# EAGLE design DRV10987 (EAGLE 8.7.1)
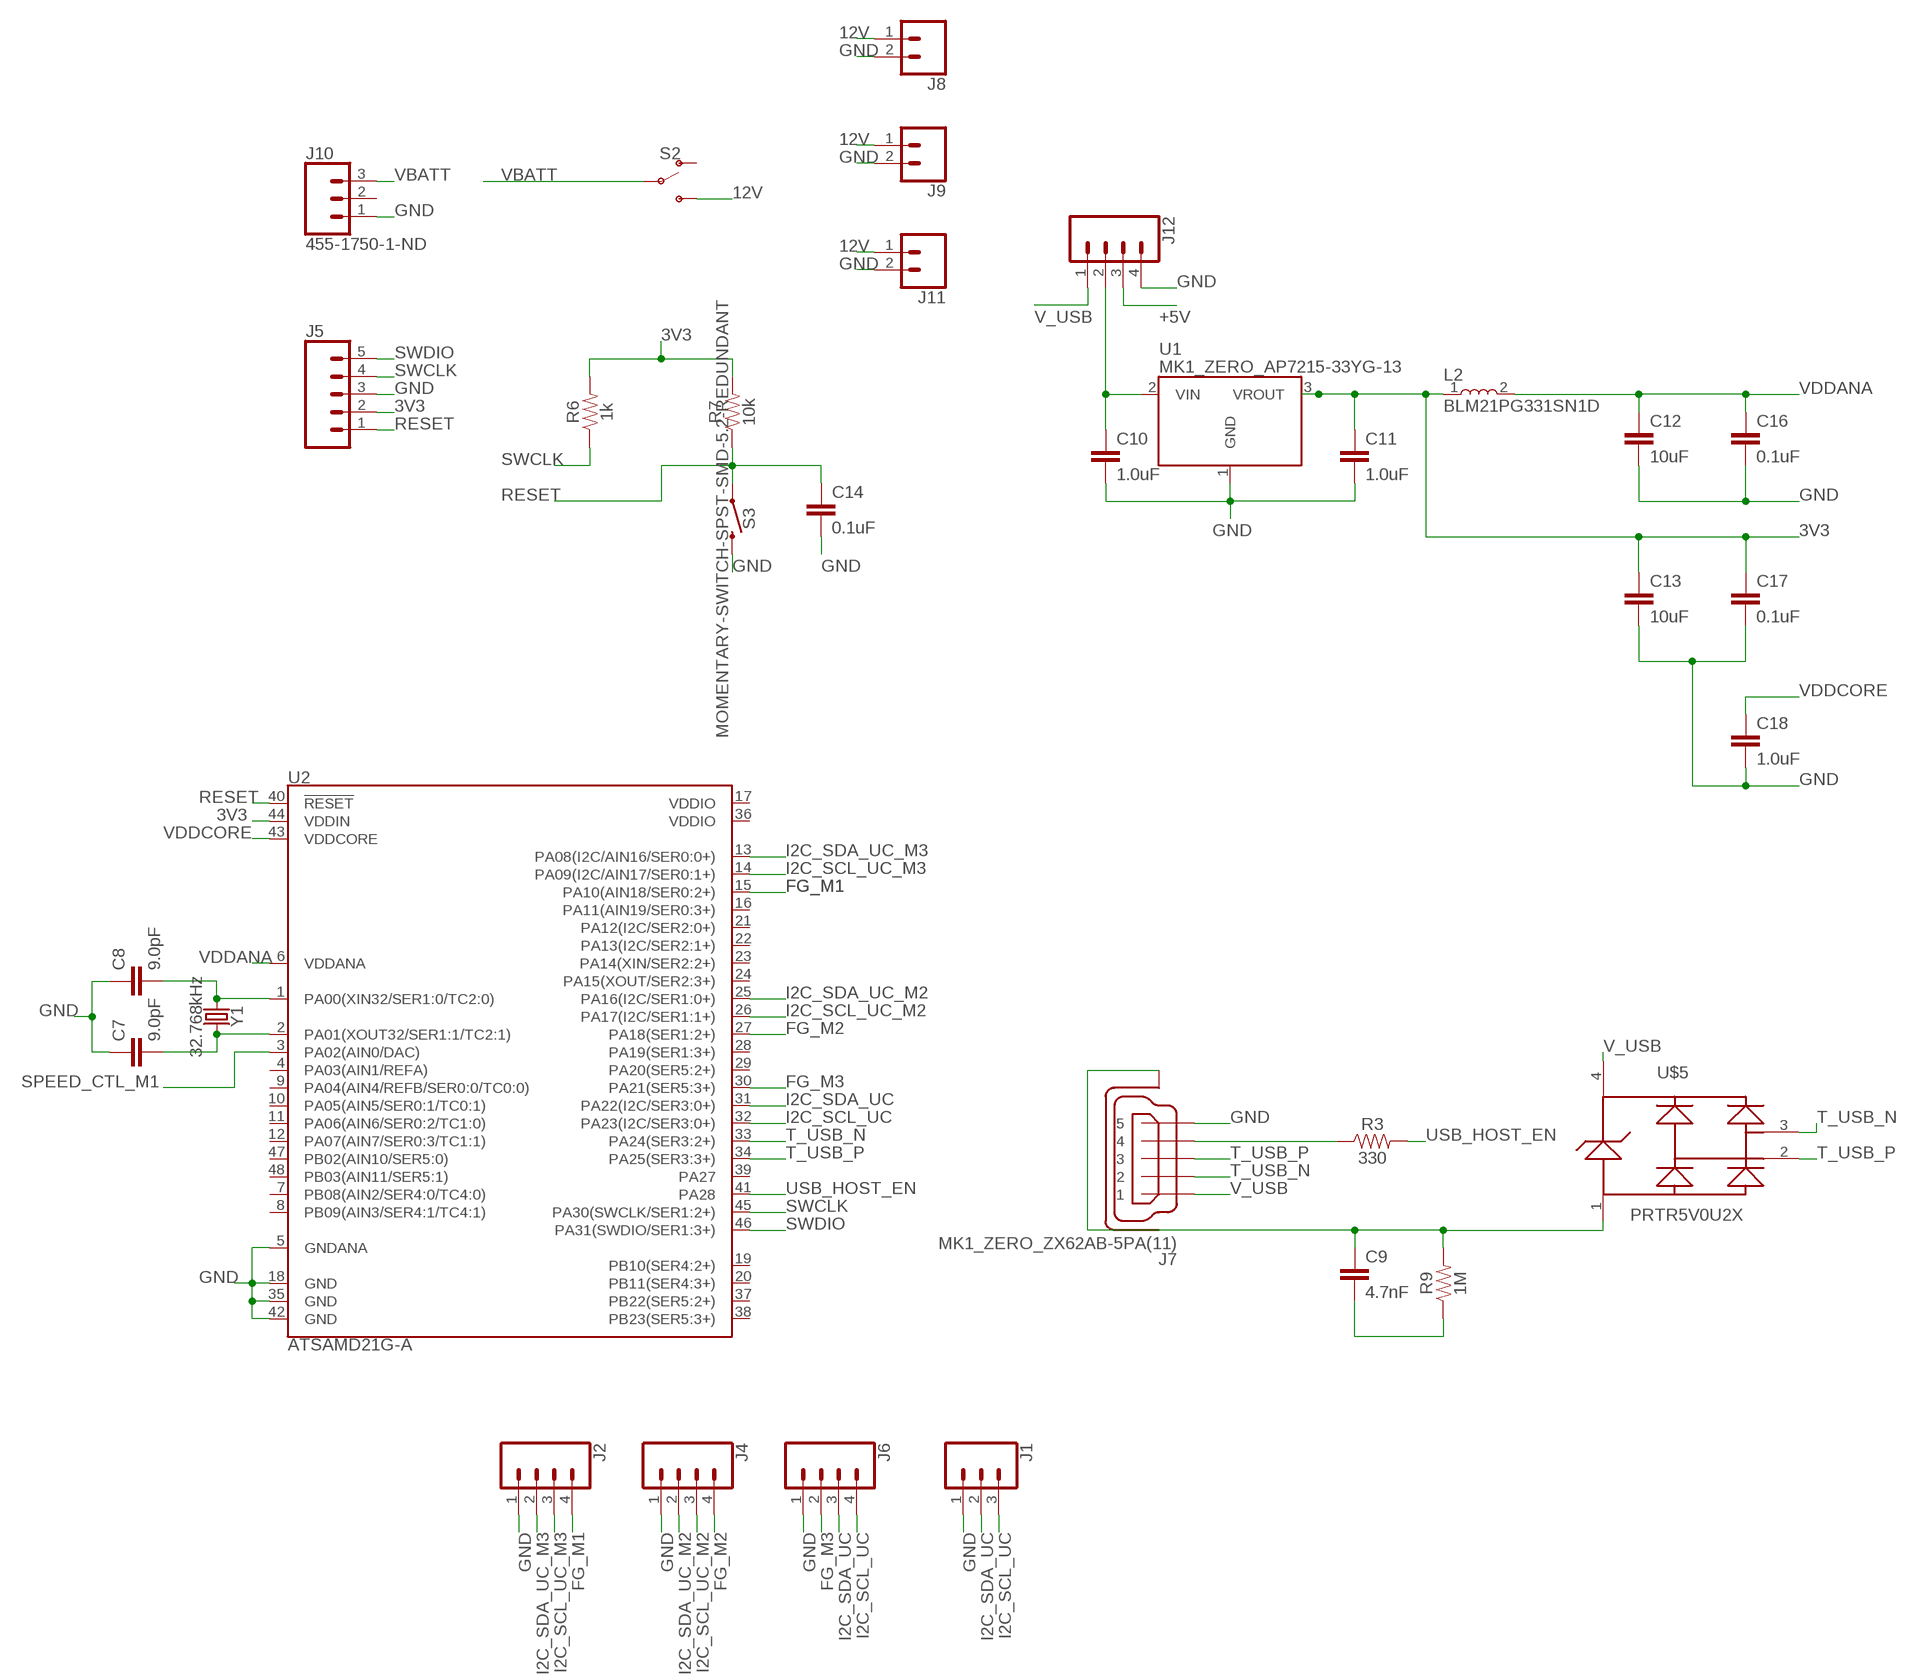
[diagram p0: schematic, sheet 1]

## Parts
C7  9.0pF  9.0PF-0603-50V-10%  [0603]
C8  9.0pF  9.0PF-0603-50V-10%  [0603]
C9  4.7nF  4.7PF-0603-50V-5%  [0603]
C10  1.0uF  1.0UF-0805-25V-(+80/-20%)  [0805]
C11  1.0uF  1.0UF-0805-25V-(+80/-20%)  [0805]
C12  10uF  10UF-0805-10V-10%  [0805]
C13  10uF  10UF-0805-10V-10%  [0805]
C14  0.1uF  1.0UF-0805-25V-(+80/-20%)  [0805]
C16  0.1uF  1.0UF-0805-25V-(+80/-20%)  [0805]
C17  0.1uF  1.0UF-0805-25V-(+80/-20%)  [0805]
C18  1.0uF  1.0UF-0805-25V-(+80/-20%)  [0805]
J1  CONN_03LOCK  [1X03_LOCK]
J2  CONN_04LOCK  [1X04_LOCK]
J4  CONN_04LOCK  [1X04_LOCK]
J5  CONN_05LOCK_LONGPADS  [1X05_LOCK_LONGPADS]
J6  CONN_04LOCK  [1X04_LOCK]
J7  MK1_ZERO_ZX62AB-5PA(11)  [MK1_ZERO_USBMICRO-ZX62-AB-5PA]
J8  CONN_02LOCK  [1X02_LOCK]
J9  CONN_02LOCK  [1X02_LOCK]
J10  455-1750-1-ND  CONN_03  [1X03]
J11  CONN_02LOCK  [1X02_LOCK]
J12  CONN_04LOCK  [1X04_LOCK]
L2  BLM21PG331SN1D  [INDC2012X87]
R3  330  330OHM-0603-1/10W-1%  [0603]
R6  1k  1KOHM-0603-1/10W-1%  [0603]
R7  10k  10KOHM-0603-1/10W-1%  [0603]
R9  1M  1MOHM-0603-1/4W-5%  [0603]
S2  SWITCH-SPDT-PTH-11.6X4.0MM  [SWITCH_SPDT_PTH_11.6X4.0MM]
S3  MOMENTARY-SWITCH-SPST-SMD-5.2-REDUNDANT  [TACTILE_SWITCH_SMD_5.2MM]
U1  MK1_ZERO_AP7215-33YG-13  [MK1_ZERO_SOT150P400X160-3N]
U2  ATSAMD21G-A  [TQFP-48]
U$5  ARDUINO_PRTR5V0U2XB  [ARDUINO_SOT143B]
Y1  32.768kHz  CRYSTAL-32.768KHZSMD-3.2X1.5  [CRYSTAL-SMD-3.2X1.5MM]

## Nets
3V3: C11.1 C13.1 C17.1 J5.2 L2.1 R6.2 R7.2 U1.3(VROUT) U2.44(VDDIN)
12V: J8.1 J9.1 J11.1 S2.3(S)
+5V: J12.3
FG_M1: J2.4 U2.15(PA10(AIN18/SER0:2+))
FG_M2: J4.4 U2.27(PA18(SER1:2+))
FG_M3: J6.2 U2.30(PA21(SER5:3+))
GND: C7.1 C8.1 C10.2 C11.2 C12.2 C13.2 C14.2 C16.2 C17.2 C18.2 J1.1 J2.1 J4.1 J5.3 J6.1 J7.5 J8.2 J9.2 J10.1 J11.2 J12.4 S3.3 S3.4 U1.1(GND) U2.5(GNDANA) U2.18(GND) U2.35(GND) U2.42(GND)
I2C_SCL_UC: J1.3 J6.4 U2.32(PA23(I2C/SER3:0+))
I2C_SCL_UC_M2: J4.3 U2.26(PA17(I2C/SER1:1+))
I2C_SCL_UC_M3: J2.3 U2.14(PA09(I2C/AIN17/SER0:1+))
I2C_SDA_UC: J1.2 J6.3 U2.31(PA22(I2C/SER3:0+))
I2C_SDA_UC_M2: J4.2 U2.25(PA16(I2C/SER1:0+))
I2C_SDA_UC_M3: J2.2 U2.13(PA08(I2C/AIN16/SER0:0+))
N$1: J7.4 R3.1
N$8: C7.2 U2.2(PA01(XOUT32/SER1:1/TC2:1)) Y1.P$2
N$10: C8.2 U2.1(PA00(XIN32/SER1:0/TC2:0)) Y1.P$1
N$17: C9.1 J7.6(SH) J7.7(SH) J7.8(SH) J7.9(SH) J7.10(SH) J7.11(SH) R9.2 U$5.1
N$19: C9.2 R9.1
N$20: C10.1 J12.2 U1.2(VIN)
RESET: C14.1 J5.1 R7.1 S3.1 S3.2 U2.40(!RESET!)
SPEED_CTL_M1: U2.3(PA02(AIN0/DAC))
SWCLK: J5.4 R6.1 U2.45(PA30(SWCLK/SER1:2+))
SWDIO: J5.5 U2.46(PA31(SWDIO/SER1:3+))
T_USB_N: J7.2 U2.33(PA24(SER3:2+)) U$5.3
T_USB_P: J7.3 U2.34(PA25(SER3:3+)) U$5.2
USB_HOST_EN: R3.2 U2.41(PA28)
V_USB: J7.1 J12.1 U$5.4
VBATT: J10.3 S2.2(P)
VDDANA: C12.1 C16.1 L2.2 U2.6(VDDANA)
VDDCORE: C18.1 U2.43(VDDCORE)
Unconnected: J10.2 S2.1(O) U2.4(PA03(AIN1/REFA)) U2.7(PB08(AIN2/SER4:0/TC4:0)) U2.8(PB09(AIN3/SER4:1/TC4:1)) U2.9(PA04(AIN4/REFB/SER0:0/TC0:0)) U2.10(PA05(AIN5/SER0:1/TC0:1)) U2.11(PA06(AIN6/SER0:2/TC1:0)) U2.12(PA07(AIN7/SER0:3/TC1:1)) U2.16(PA11(AIN19/SER0:3+)) U2.17(VDDIO) U2.19(PB10(SER4:2+)) U2.20(PB11(SER4:3+)) U2.21(PA12(I2C/SER2:0+)) U2.22(PA13(I2C/SER2:1+)) U2.23(PA14(XIN/SER2:2+)) U2.24(PA15(XOUT/SER2:3+)) U2.28(PA19(SER1:3+)) U2.29(PA20(SER5:2+)) U2.36(VDDIO) U2.37(PB22(SER5:2+)) U2.38(PB23(SER5:3+)) U2.39(PA27) U2.47(PB02(AIN10/SER5:0)) U2.48(PB03(AIN11/SER5:1))

## Library data of the parts
C7 C8 = SparkFun-Capacitors:9.0PF: 9.0pF ceramic capacitors A capacitor is a passive two-terminal electrical component used to store electrical energy temporarily in an electric field.; PROD_ID: CAP-09341
C9 = SparkFun-Capacitors:4.7PF: 4.7pF ceramic capacitors A capacitor is a passive two-terminal electrical component used to store electrical energy temporarily in an electric field.; PROD_ID: CAP-07880; VALUE: 4.7pF
C10 C11 C18 = SparkFun-Capacitors:1.0UF: 1µF ceramic capacitors A capacitor is a passive two-terminal electrical component used to store electrical energy temporarily in an electric field.; PROD_ID: CAP-11625
C12 C13 = SparkFun-Capacitors:10UF: 10.0µF ceramic capacitors A capacitor is a passive two-terminal electrical component used to store electrical energy temporarily in an electric field.; PROD_ID: CAP-11330
C14 C16 C17 = SparkFun-Capacitors:1.0UF: 1µF ceramic capacitors A capacitor is a passive two-terminal electrical component used to store electrical energy temporarily in an electric field.; PROD_ID: CAP-11625; VALUE: 1.0uF
J1 = SparkFun-Connectors:CONN_03: Multi connection point. Often used as Generic Header-pin footprint for 0.1 inch spaced/style header connections On any of the 0.1 inch spaced packages, you can populate with these: Break Away Headers - Straight <https://www.sparkfun.com/products/116> (PRT-00116) Break Away Male Headers - Right Angle <https://www.sparkfun.com/products/553> (PRT-00553) Female Headers <https://www.sparkfun.com/products/115> (PRT-00115) Break Away Headers - Machine Pin <https://www.sparkfun.com/products/117> (PRT-00117) Break Away Female Headers - Swiss Machine Pin <https://www.sparkfun.com/products/743> (PRT-00743) Stackable Header - 3 Pin (Female, 0.1") <https://www.sparkfun.com/products/13875> (PRT-13875) For SCREWTERMINALS and SPRING TERMINALS visit here: Screw Terimnals on SparkFun.com <https://www.sparkfun.com/search/results?term=Screw+Terminals> (5mm/3.5mm/2.54mm spacing) This device is also useful as a general connection point to wire up your design to another part of your project. Our various solder wires solder well into these plated through hole pads. Hook-Up Wire - Assortment (Stranded, 22 AWG) <https://www.sparkfun.com/products/11375> (PRT-11375) Hook-Up Wire - Assortment (Solid Core, 22 AWG) <https://www.sparkfun.com/products/11367> (PRT-11367) View the entire wire category on our website here <https://www.sparkfun.com/categories/141> Special notes: Molex polarized connector foot print use with SKU : PRT-08232 with associated crimp pins and housings.
J2 J4 J6 J12 = SparkFun-Connectors:CONN_04: Multi connection point. Often used as Generic Header-pin footprint for 0.1 inch spaced/style header connections On any of the 0.1 inch spaced packages, you can populate with these: Break Away Headers - Straight <https://www.sparkfun.com/products/116> (PRT-00116) Break Away Male Headers - Right Angle <https://www.sparkfun.com/products/553> (PRT-00553) Female Headers <https://www.sparkfun.com/products/115> (PRT-00115) Break Away Headers - Machine Pin <https://www.sparkfun.com/products/117> (PRT-00117) Break Away Female Headers - Swiss Machine Pin <https://www.sparkfun.com/products/743> (PRT-00743) For SCREWTERMINALS and SPRING TERMINALS visit here: Screw Terimnals on SparkFun.com <https://www.sparkfun.com/search/results?term=Screw+Terminals> (5mm/3.5mm/2.54mm spacing) This device is also useful as a general connection point to wire up your design to another part of your project. Our various solder wires solder well into these plated through hole pads. Hook-Up Wire - Assortment (Stranded, 22 AWG) <https://www.sparkfun.com/products/11375> (PRT-11375) Hook-Up Wire - Assortment (Solid Core, 22 AWG) <https://www.sparkfun.com/products/11367> (PRT-11367) View the entire wire category on our website here <https://www.sparkfun.com/categories/141> Special notes: Molex polarized connector foot print use with SKU : PRT-08231 with associated crimp pins and housings. 1MM SMD Version SKU: PRT-10208; PROD_ID: CONN-09696
J5 = SparkFun-Connectors:CONN_05: Multi connection point. Often used as Generic Header-pin footprint for 0.1 inch spaced/style header connections On any of the 0.1 inch spaced packages, you can populate with these: Break Away Headers - Straight <https://www.sparkfun.com/products/116> (PRT-00116) Break Away Male Headers - Right Angle <https://www.sparkfun.com/products/553> (PRT-00553) Female Headers <https://www.sparkfun.com/products/115> (PRT-00115) Break Away Headers - Machine Pin <https://www.sparkfun.com/products/117> (PRT-00117) Break Away Female Headers - Swiss Machine Pin <https://www.sparkfun.com/products/743> (PRT-00743) For SCREWTERMINALS and SPRING TERMINALS visit here: Screw Terimnals on SparkFun.com <https://www.sparkfun.com/search/results?term=Screw+Terminals> (5mm/3.5mm/2.54mm spacing) This device is also useful as a general connection point to wire up your design to another part of your project. Our various solder wires solder well into these plated through hole pads. Hook-Up Wire - Assortment (Stranded, 22 AWG) <https://www.sparkfun.com/products/11375> (PRT-11375) Hook-Up Wire - Assortment (Solid Core, 22 AWG) <https://www.sparkfun.com/products/11367> (PRT-11367) View the entire wire category on our website here <https://www.sparkfun.com/categories/141> Special notes: Molex polarized connector foot print use with SKU : PRT-08231 with associated crimp pins and housings. 1MM SMD Version SKU: PRT-10208
J7 = MKRZero_V5.0:MK1_ZERO_ZX62AB-5PA(11)
J8 J9 J11 = SparkFun-Connectors:CONN_02: Multi connection point. Often used as Generic Header-pin footprint for 0.1 inch spaced/style header connections On any of the 0.1 inch spaced packages, you can populate with these: Break Away Headers - Straight <https://www.sparkfun.com/products/116> (PRT-00116) Break Away Male Headers - Right Angle <https://www.sparkfun.com/products/553> (PRT-00553) Female Headers <https://www.sparkfun.com/products/115> (PRT-00115) Break Away Headers - Machine Pin <https://www.sparkfun.com/products/117> (PRT-00117) Break Away Female Headers - Swiss Machine Pin <https://www.sparkfun.com/products/743> (PRT-00743) For SCREWTERMINALS and SPRING TERMINALS visit here: Screw Terimnals on SparkFun.com <https://www.sparkfun.com/search/results?term=Screw+Terminals> (5mm/3.5mm/2.54mm spacing) This device is also useful as a general connection point to wire up your design to another part of your project. Our various solder wires solder well into these plated through hole pads. Hook-Up Wire - Assortment (Stranded, 22 AWG) <https://www.sparkfun.com/products/11375> (PRT-11375) Hook-Up Wire - Assortment (Solid Core, 22 AWG) <https://www.sparkfun.com/products/11367> (PRT-11367) View the entire wire category on our website here <https://www.sparkfun.com/categories/141> Special notes: Molex polarized connector foot print use with: PRT-08233 with associated crimp pins and housings. 2.54_SCREWTERM for use with PRT-10571. 3.5mm Screw Terminal footprints for PRT-08084 5mm Screw Terminal footprints for use with PRT-08432
J10 = SparkFun-Connectors:CONN_03: Multi connection point. Often used as Generic Header-pin footprint for 0.1 inch spaced/style header connections On any of the 0.1 inch spaced packages, you can populate with these: Break Away Headers - Straight <https://www.sparkfun.com/products/116> (PRT-00116) Break Away Male Headers - Right Angle <https://www.sparkfun.com/products/553> (PRT-00553) Female Headers <https://www.sparkfun.com/products/115> (PRT-00115) Break Away Headers - Machine Pin <https://www.sparkfun.com/products/117> (PRT-00117) Break Away Female Headers - Swiss Machine Pin <https://www.sparkfun.com/products/743> (PRT-00743) Stackable Header - 3 Pin (Female, 0.1") <https://www.sparkfun.com/products/13875> (PRT-13875) For SCREWTERMINALS and SPRING TERMINALS visit here: Screw Terimnals on SparkFun.com <https://www.sparkfun.com/search/results?term=Screw+Terminals> (5mm/3.5mm/2.54mm spacing) This device is also useful as a general connection point to wire up your design to another part of your project. Our various solder wires solder well into these plated through hole pads. Hook-Up Wire - Assortment (Stranded, 22 AWG) <https://www.sparkfun.com/products/11375> (PRT-11375) Hook-Up Wire - Assortment (Solid Core, 22 AWG) <https://www.sparkfun.com/products/11367> (PRT-11367) View the entire wire category on our website here <https://www.sparkfun.com/categories/141> Special notes: Molex polarized connector foot print use with SKU : PRT-08232 with associated crimp pins and housings.; PROD_ID: XXX-00000
L2 = Common-Parts-Library-Eagle:BLM21PG331SN1D: Ferrite Beads Multi-Layer 330Ohm 25% 100MHz 1.5A 70mOhm DCR 0805 Paper T/R; MANUFACTURER: MURATA
R3 = SparkFun-Resistors:330OHM: 330Ω resistor A resistor is a passive two-terminal electrical component that implements electrical resistance as a circuit element. Resistors act to reduce current flow, and, at the same time, act to lower voltage levels within circuits. - Wikipedia; PROD_ID: RES-00818
R6 = SparkFun-Resistors:1KOHM: 1kΩ resistor A resistor is a passive two-terminal electrical component that implements electrical resistance as a circuit element. Resistors act to reduce current flow, and, at the same time, act to lower voltage levels within circuits. - Wikipedia; PROD_ID: RES-07856
R7 = SparkFun-Resistors:10KOHM: 10kΩ resistor A resistor is a passive two-terminal electrical component that implements electrical resistance as a circuit element. Resistors act to reduce current flow, and, at the same time, act to lower voltage levels within circuits. - Wikipedia; PROD_ID: RES-00824
R9 = SparkFun-Resistors:1MOHM: 1MΩ resistor A resistor is a passive two-terminal electrical component that implements electrical resistance as a circuit element. Resistors act to reduce current flow, and, at the same time, act to lower voltage levels within circuits. - Wikipedia; PROD_ID: RES-07868
S2 = SparkFun-Switches:SWITCH-SPDT: Single Pole, Double Throw (SPDT) Switch Single-pole, double-throw (SPDT) switch. Variant Overview SMD-AYZ0202 Surface Mount DPDT Switch <https://www.sparkfun.com/products/597> (COM-00597) Used on e.g. LilyPad Arduino USB - ATmega32U4 Board <https://www.sparkfun.com/products/12049> PTH-11.6X4.0MM SPDT Mini Power Switch <https://www.sparkfun.com/products/102> (COM-00102) Used on e.g. SparkFun Simon Says - Through-Hole Soldering Kit <https://www.sparkfun.com/products/10547> (KIT-10547) PTH-11.6X4.0MM-KIT KIT version of SPDT Mini Power Switch - Simplifies soldering by removing tStop of switch pins - only one side can be soldered. PTH-11.6X4.0MM-LOCK LOCK version of SPDT Mini Power Switch - Offset pins hold switch in place for easier soldering. SMD-RIGHT-ANGLE Surface Mount Right Angle Switch <https://www.sparkfun.com/products/10860> (COM-10860) Used on e.g. SparkFun ESP8266 Thing <https://www.sparkfun.com/products/13231>; PROD_ID: SWCH-08261; SF_SKU: COM-00102
S3 = SparkFun-Switches:MOMENTARY-SWITCH-SPST: Momentary Switch (Pushbutton) - SPST Normally-open (NO) SPST momentary switches (buttons, pushbuttons). Variants PTH-12MM - 12mm square, through-hole Momentary Pushbutton Switch - 12mm Square <https://www.sparkfun.com/products/9190> (COM-09190) PTH-6.0MM, PTH-6.0MM-KIT - 6.0mm square, through-hole Mini Pushbutton Switch <https://www.sparkfun.com/products/97> (COM-00097) KIT package intended for soldering kit's - only one side of pads' copper is exposed. PTH-RIGHT-ANGLE-KIT - Right-angle, through-hole Right Angle Tactile Button <https://www.sparkfun.com/products/10791> - Used on SparkFun BigTime Watch Kit <https://www.sparkfun.com/products/11734> SMD-12MM - 12mm square, surface-mount Tactile Button - SMD (12mm) <https://www.sparkfun.com/products/12993> (COM-12993) Used on SparkFun PicoBoard <https://www.sparkfun.com/products/11888> SMD-4.5MM - 4.5mm Square Trackball Switch Used on SparkFun Blackberry Trackballer Breakout <https://www.sparkfun.com/products/13169> SMD-4.6MMX2.8MM - 4.60mm x 2.80mm, surface mount Used on SparkFun SAMD21 Mini Breakout <https://www.sparkfun.com/products/13664> SMD-5.2MM, SMD-5.2-REDUNDANT - 5.2mm square, surface-mount Mini Pushbutton Switch - SMD <https://www.sparkfun.com/products/8720> (COM-08720) Used on Arduino Pro Mini <https://www.sparkfun.com/products/11114> REDUNDANT package connects both switch circuits together SMD-6.0X3.5MM - 6.0 x 3.5mm, surface mount Momentary Reset Switch SMD <https://www.sparkfun.com/products/8229> (COM-08229) SMD-6.2MM-TALL - 6.2mm square, surface mount Tactile Button - SMD (6mm) <https://www.sparkfun.com/products/12992> Used on SparkFun Digital Sandbox <https://www.sparkfun.com/products/12651> SMD-RIGHT-ANGLE - Right-angle, surface mount Used on SparkFun Block for Intel® Edison - Arduino <https://www.sparkfun.com/products/13036>; PROD_ID: SWCH-08247; SF_SKU: COM-08720
U1 = MKRZero_V5.0:MK1_ZERO_AP7215-33YG-13: IC REG LDO 3.3V 0.6A SOT89-3 Datasheet <http://www.diodes.com/_files/datasheets/AP7215.pdf>; DESCR: IC REG LDO 3.3V 0.6A SOT89-3; MF: Diodes Inc; MPN: AP7215-33YG-13
U2 = SparkFun-IC-Microcontroller:ATSAMD21G: Atmel SAMD21G SMART ARM-Based Microcontroller The Atmel ® | SMART ™ SAM D21 is a series of low-power microcontrollers using the 32-bit ARM ® Cortex ® -M0+ processor, and ranging from 32- to 64-pins with up to 256KB Flash and 32KB of SRAM. The SAM D21 devices operate at a maximum frequency of 48MHz and reach 2.46 CoreMark/MHz. They are designed for simple and intuitive migration with identical peripheral modules, hex compatible code, identical linear address map and pin compatible migration paths between all devices in the product series. All devices include intelligent and flexible peripherals, Atmel Event System for inter-peripheral signaling, and support for capacitive touch button, slider and wheel user interfaces. Datasheet <https://cdn.sparkfun.com/datasheets/Dev/Arduino/Boards/Atmel-42181-SAM-D21_Datasheet.pdf> SparkFun Products SparkFun SAMD21 Mini Breakout <https://www.sparkfun.com/products/13664> (DEV-13664) SparkFun SAMD21 Dev Breakout <https://www.sparkfun.com/products/13672> (DEV-13672); PROD_ID: IC-13064
U$5 = Zero_V1.0:ARDUINO_PRTR5V0U2X
Y1 = SparkFun-Clocks:CRYSTAL-32.768KHZ: 32.768kHz Crystal Frequency: 32.768kHz Frequency Stability: ±20ppm Load Capacitance: 12.5pF (PTH-2X6 & SMD-3.2X1.5), 6pF (SMD-2X6) SparkFun Products: SparkFun BigTime Watch Kit <https://www.sparkfun.com/products/11734> SparkFun nRF52832 Breakout <https://www.sparkfun.com/products/13990> SparkFun Real Time Clock Module <https://www.sparkfun.com/products/12708>; PROD_ID: XTAL-13062

## Board
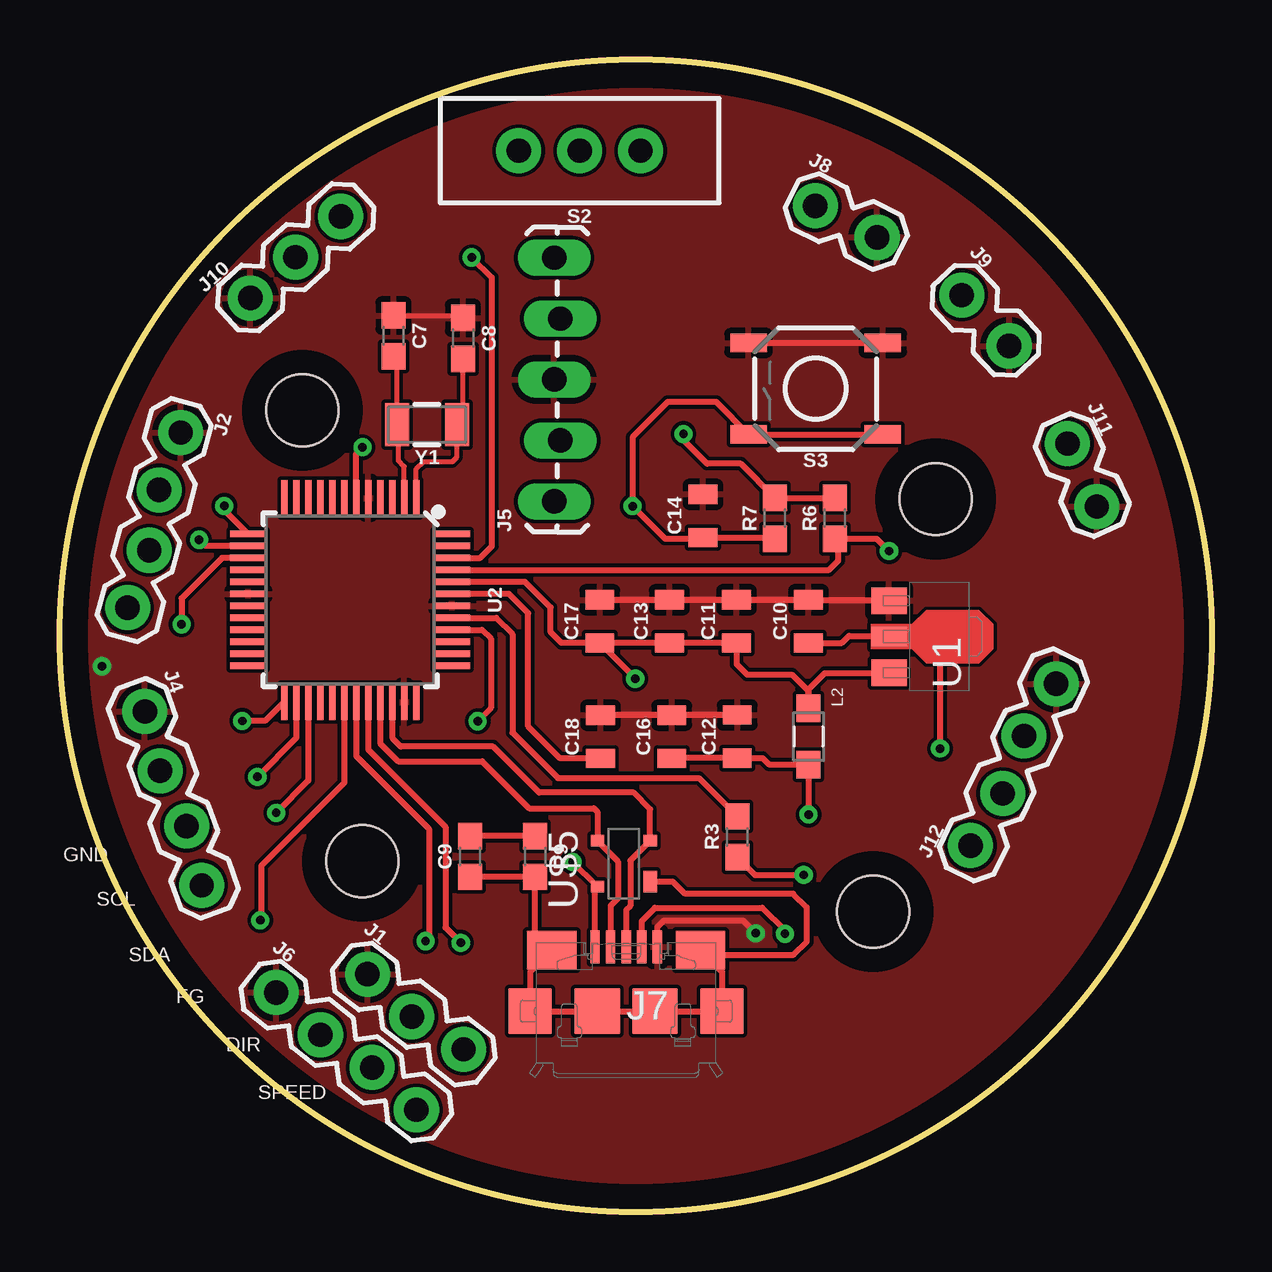
[diagram p1: board, top side]
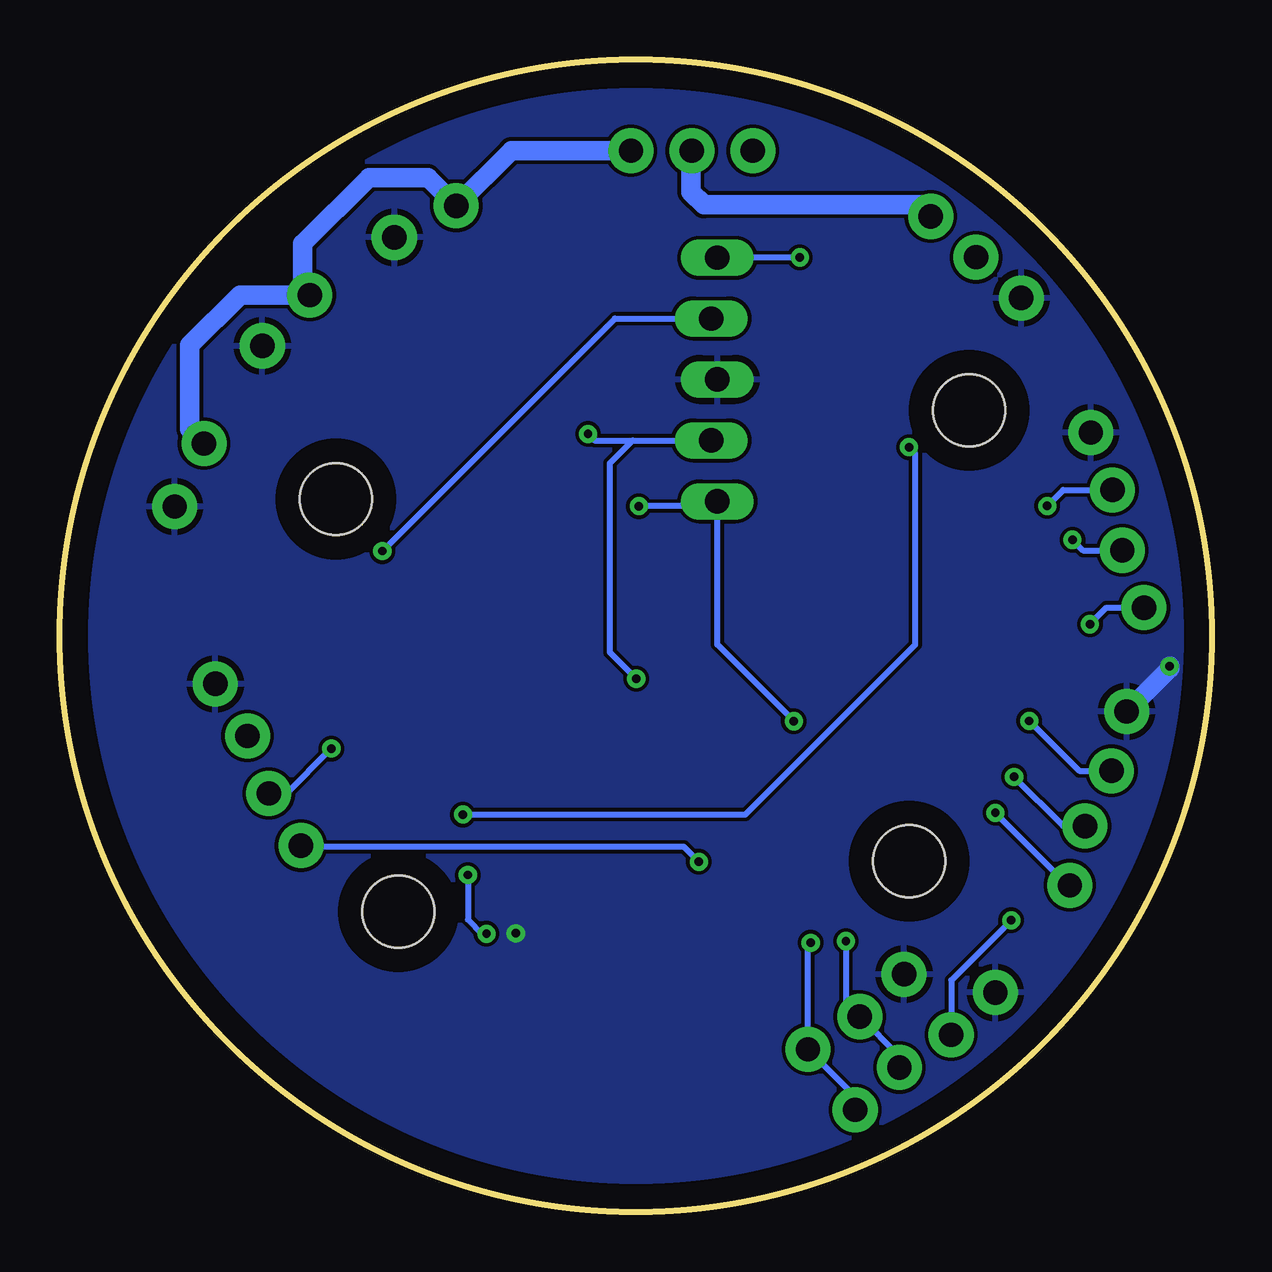
[diagram p2: board, bottom side, seen from below]

Size 48 x 48 mm. Coordinates in mm from the lower left corner, seen from the top.
Outline: circle at 24,24 radius 24
Copper layers (1*16): Top 0.035mm / dielectric 1.5mm / Bottom 0.035mm
Design rules "default": minimum track width 6mil, minimum drill 0.35mm, track to track 6mil, track to pad 6mil, pad to pad 6mil, via to via 6mil, smd to smd 6mil, copper to edge 40mil, drill to drill 6mil, minimum pad ring 10mil, minimum via ring 8mil, stop-mask expansion 4mil, vias tented up to drill 0mil, thermal gap 10mil
Holes 3 mm at 33.9,12.5 36.5,29.7 10.1,33.4 12.6,14.6

### Footprints (pad centres in the part's own frame; a part is rotated, then mirrored left to right if it is on the bottom)
0603 = smd 1.1 x 1: 1 -0.85,0; 2 0.85,0
0805 = smd 0.8 x 1.2: 1 -0.9,0; 2 0.9,0
1X03_LOCK = drill 1.016 pad 1.88: 1 0,0.127; 2 2.54,-0.127; 3 5.08,0.127
1X04_LOCK = drill 1.016 pad 1.88: 1 0,0.127; 2 2.54,-0.127; 3 5.08,0.127; 4 7.62,-0.127
1X05_LOCK_LONGPADS = drill 1.016 long: 1 0,0; 2 2.54,-0.254; 3 5.08,0; 4 7.62,-0.254; 5 10.16,0
MK1_ZERO_USBMICRO-ZX62-AB-5PA = smd 0.4 x 1.35: 1 -1.3,3.025; 2 -0.65,3.025; 3 0,3.025; 4 0.65,3.025; 5 1.3,3.025 | smd 2.1 x 1.6: 6 3.1,2.9; 11 -3.1,2.9 | smd 1.8 x 1.9: 7 4,0.35; 10 -4,0.35 | smd 1.9 x 1.9: 8 1.2,0.35; 9 -1.2,0.35
1X02_LOCK = drill 1.016 pad 1.88: 1 -0.178,0; 2 2.718,0
1X03 = drill 1.016 pad 1.88: 1 0,0; 2 2.54,0; 3 5.08,0
INDC2012X87 = smd 1.15 x 1: 1 -1.175,0; 2 1.175,0
SWITCH_SPDT_PTH_11.6X4.0MM = drill 1.016 pad 1.88: 1 0,2.54; 2 0,0; 3 0,-2.54
TACTILE_SWITCH_SMD_5.2MM = smd 1.524 x 0.762: 1 -2.794,1.905; 2 2.794,1.905; 3 -2.794,-1.905; 4 2.794,-1.905
MK1_ZERO_SOT150P400X160-3N = smd 1.1 x 1.5: 1 -1.5,-1.8; 3 1.5,-1.8 | smd 0.8 x 1.5: 2 0,-1.8
TQFP-48 = smd 1.5 x 0.28: 1 -4.25,2.75; 2 -4.25,2.25; 3 -4.25,1.75; 4 -4.25,1.25; 5 -4.25,0.75; 6 -4.25,0.25; 7 -4.25,-0.25; 8 -4.25,-0.75; 9 -4.25,-1.25; 10 -4.25,-1.75; 11 -4.25,-2.25; 12 -4.25,-2.75; 25 4.25,-2.75; 26 4.25,-2.25; 27 4.25,-1.75; 28 4.25,-1.25; 29 4.25,-0.75; 30 4.25,-0.25; 31 4.25,0.25; 32 4.25,0.75; 33 4.25,1.25; 34 4.25,1.75; 35 4.25,2.25; 36 4.25,2.75 | smd 0.28 x 1.5: 13 -2.75,-4.25; 14 -2.25,-4.25; 15 -1.75,-4.25; 16 -1.25,-4.25; 17 -0.75,-4.25; 18 -0.25,-4.25; 19 0.25,-4.25; 20 0.75,-4.25; 21 1.25,-4.25; 22 1.75,-4.25; 23 2.25,-4.25; 24 2.75,-4.25; 37 2.75,4.25; 38 2.25,4.25; 39 1.75,4.25; 40 1.25,4.25; 41 0.75,4.25; 42 0.25,4.25; 43 -0.25,4.25; 44 -0.75,4.25; 45 -1.25,4.25; 46 -1.75,4.25; 47 -2.25,4.25; 48 -2.75,4.25
ARDUINO_SOT143B = smd 0.88 x 0.55: 1 -0.75,-1.1 | smd 0.48 x 0.55: 2 0.95,-1.1; 3 0.95,1.1; 4 -0.95,1.1
CRYSTAL-SMD-3.2X1.5MM = smd 1 x 1.8: P$1 -1.25,0; P$2 1.25,0

### Placement (x,y rotation side)
C7  13.9,36.5 270 top
C8  16.8,36.4 270 top
C9  17.1,14.8 90 top
C10  31.2,24.6 90 top
C11  28.2,24.6 90 top
C12  28.23,19.8 90 top
C13  25.4,24.6 90 top
C14  26.8,29 90 top
C16  25.5,19.79 90 top
C17  22.5,24.6 90 top
C18  22.53,19.79 90 top
J1  12.74,9.79 322 top
J2  4.91,32.5 255 top
J4  3.42,20.8 290 top
J5  20.6,29.6 90 top
J6  8.93,9.03 322 top
J7  23.6,8 0 top
J8  31.64,41.84 333 top
J9  37.71,38.07 313 top
J10  7.93,38.08 42 top
J11  42.07,31.85 295 top
J12  38.07,15.2 64 top
L2  31.2,19.8 270 top
R3  28.23,15.62 90 top
R6  32.3,28.9 90 top
R7  29.8,28.9 90 top
R9  19.8,14.8 270 top
S2  21.66,44.22 90 top
S3  31.5,34.3 180 top
U1  36.36,23.96 270 top
U2  12.1,25.5 270 top
U$5  23.5,14.5 90 top
Y1  15.3,32.8 180 top

### Tracks (layer width: path | path; a pad name or v marks a point on that pad's centre or on a via)
3V3  (via drill 0.35)
  Top 0.254: U1.3 34.54,22.44 31.88,22.44 31.2,21.76 L2.1 31.2,21.69 30.51,22.38 28.64,22.38 28.2,22.82 C11.1 C13.1 C17.1 | C17.1 20.9,23.7 20.45,24.15 20.45,25.18 19.38,26.25 U2.44 | C17.1 v23.98,22.22 v23.98,22.21 | v25.99,32.41 25.99,32.15 26.97,31.17 28.38,31.17 R7.2 R6.2
  Bottom 0.254: v23.98,22.21 25.08,23.31 25.08,31.19 24.13,32.14 | 24.13,32.14 J5.2 | v25.99,32.41 25.72,32.14 24.13,32.14
12V
  Bottom 0.813: S2.3 29.18,44.22 J8.1 32.66,43.1 35.12,43.1 37.88,40.34 37.88,38.49 J9.1 40.5,38.2 42.59,36.11 42.59,32.61 J11.1
FG_M1  (via drill 0.35)
  Top 0.254: U2.15 6.76,27.25 5.07,25.56 v5.07,24.48
  Bottom 0.254: v5.07,24.48 4.38,25.17 J2.4
FG_M2  (via drill 0.35)
  Top 0.254: U2.27 10.35,17.96 v9.01,16.62
  Bottom 0.254: v9.01,16.62 5.99,13.6 J4.4
FG_M3  (via drill 0.35)
  Top 0.254: U2.30 11.85,17.87 8.39,14.41 8.39,12.18 v8.35,12.14
  Bottom 0.254: v8.35,12.14 10.85,9.64 J6.2
GND  (via drill 0.35)
  Top 0.203: C7.1 16.7,37.35 C8.1
  Top 0.254: U1.1 34.52,25.5 C10.2 C11.2 C13.2 C17.2 | C12.2 C16.2 C18.2 | J7.5 24.9,11.86 25.17,12.13 28.47,12.13 v29,11.6 | S3.3 S3.4
  Bottom 0.813: J4.1 1.75,22.63 v1.75,22.73
  pour Top: 0.56,28.4 2.83,35.13 5.83,39.57 10.05,43.35 16.22,46.47 24.11,47.86 32.94,46.3 39.16,42.58 43.77,37.52 47.15,30.29 47.71,22.4 45.6,13.95 41.99,8.22 36.6,3.67 29.83,0.89 21.16,0.27 13.39,2.5 6.5,7.83 2.06,14.28 0.33,20.73 0.55,28.43
  pour Bottom: 0.27,27.18 2.94,35.45 7.19,40.88 13.77,45.6 21.03,47.83 31.08,46.86 37.83,43.57 42.74,38.7 46.95,30.69 47.83,22.12 45.33,13.46 42.04,8.46 37.09,4.15 31.03,1.14 23.25,0.12 14.83,2.06 7.98,6.28 4.23,10.63 1.06,17.45 0.29,27.18
I2C_SCL_UC  (via drill 0.35)
  Top 0.254: U2.32 12.85,19.26 16.07,16.04 16.07,11.84 v16.71,11.2
  Bottom 0.152: 16.71,6.87 J1.3
  Bottom 0.254: J6.4 14.86,4.8 J1.3 16.82,11.09 v16.71,11.2
I2C_SCL_UC_M2  (via drill 0.35)
  Top 0.254: U2.26 9.85,19.74 v8.23,18.12
  Bottom 0.254: v8.23,18.12 6.18,16.07 J4.3
I2C_SCL_UC_M3  (via drill 0.35)
  Top 0.254: U2.14 6.05,27.75 v5.8,28
  Bottom 0.254: v5.8,28 5.36,27.56 J2.3
I2C_SDA_UC  (via drill 0.35)
  Top 0.254: U2.31 12.35,18.98 15.38,15.95 15.38,11.41 v15.24,11.27
  Bottom 0.254: v15.24,11.27 15.24,8.7 J1.2 13.01,6.47 J6.3
I2C_SDA_UC_M2  (via drill 0.35)
  Top 0.254: U2.25 8.55,20.45 v7.6,20.45
  Bottom 0.254: v7.6,20.45 5.52,18.37 J4.2
I2C_SDA_UC_M3  (via drill 0.35)
  Top 0.254: U2.13 6.85,29.25 v6.85,29.41
  Bottom 0.254: v6.85,29.41 6.18,30.08 J2.2
N$1  (via drill 0.35)
  Top 0.254: R3.1 28.97,14.03 v31,14.03 | J7.4 24.25,12.11 24.8,12.66 29.27,12.66 30.22,11.71 v30.22,11.58
  Bottom 0.254: v31,14.03 31,12.17 30.41,11.58 v30.22,11.58
N$8
  Top 0.203: U2.2 14.35,31.06 14.11,31.3 14.11,32.74 Y1.P$2 14.05,35.5 C7.2
N$10
  Top 0.203: U2.1 14.85,30.96 15.15,31.26 16.36,31.26 16.55,31.45 Y1.P$1 16.8,33.05 C8.2
N$17
  Top 0.254: U$5.1 25.55,13.75 26.06,13.24 29.97,13.24 29.98,13.25 30.56,13.25 31.13,12.68 31.13,11.25 30.58,10.7 26.9,10.7 J7.6 27.6,10 J7.7 J7.8 J7.9 J7.10 19.6,10 J7.11 19.8,11.6 R9.2 C9.1
N$19
  Top 0.254: R9.1 C9.2
N$20  (via drill 0.35)
  Top 0.254: C10.1 32.59,23.7 32.89,24 34.52,24 | 34.52,24 U1.2 | v36.69,19.3 36.69,23.46 36.15,24 34.52,24
  Bottom 0.254: v36.69,19.3 38.62,17.37 38.67,17.43 J12.2
RESET  (via drill 0.35)
  Top 0.152: 26.85,28.05 C14.1
  Top 0.254: 26.85,28.05 25.22,28.05 v23.87,29.4 23.87,32.28 25.33,33.74 27.36,33.74 S3.2 S3.1 | U2.40 17.59,24.25 17.96,23.88 17.96,20.99 v17.41,20.44 | C14.1 29.75,28.1 R7.1
  Bottom 0.254: v23.87,29.4 20.8,29.4 J5.1 20.6,23.63 v17.41,20.44
SWCLK  (via drill 0.35)
  Top 0.254: R6.1 32.44,28.05 | 32.44,28.05 34.04,28.05 v34.56,27.53 | U2.45 32.06,26.75 32.44,27.13 32.44,28.05
  Bottom 0.254: v34.56,27.53 24.87,37.22 J5.4
SWDIO  (via drill 0.35)
  Top 0.254: U2.46 17.52,27.25 18,27.73 18,38.93 v17.16,39.77
  Bottom 0.254: v17.16,39.77 J5.5
T_USB_N
  Top 0.254: J7.2 22.95,12.75 23.26,13.06 23.26,14.59 U$5.3 22.4,16.66 22.25,16.81 19.56,16.81 17.6,18.77 14.1,18.77 13.35,19.52 U2.33
T_USB_P
  Top 0.152: 23.66,11.09 J7.3
  Top 0.254: J7.3 23.6,12.57 23.78,12.75 23.78,14.63 U$5.2 24.6,16.77 23.91,17.46 19.97,17.46 18.05,19.38 14.2,19.38 13.87,19.71 13.87,21.23 U2.34
USB_HOST_EN
  Top 0.254: U2.41 18.18,24.75 18.86,24.07 18.86,19.96 20.75,18.07 26.63,18.07 R3.2
V_USB  (via drill 0.35)
  Top 0.254: v21.37,14.58 U$5.4 22.3,13.45 J7.1
  Bottom 0.254: v21.37,14.58 21.99,15.2 37.9,15.2 J12.1
VBATT
  Bottom 0.813: J10.3 12.19,41.96 21.16,41.96 21.7,42.5 21.7,44.18 S2.2
VDDANA  (via drill 0.35)
  Top 0.254: C16.1 C12.1 29.29,18.9 29.55,18.64 31.19,18.64 L2.2 v31.2,16.55 | U2.6 12.35,31.6 v12.61,31.86
  Bottom 0.254: v31.2,16.55 19.43,16.55 12.35,23.63 12.35,31.6 v12.61,31.86
VDDCORE
  Top 0.254: C18.1 20.85,18.89 19.52,20.22 19.52,24.94 18.71,25.75 U2.43

### Text on the board
tPlace: GND | SCL | SDA | FG | DIR | SPEED